# EAGLE design Cansat 2018_V2  (EAGLE 7.6.0)
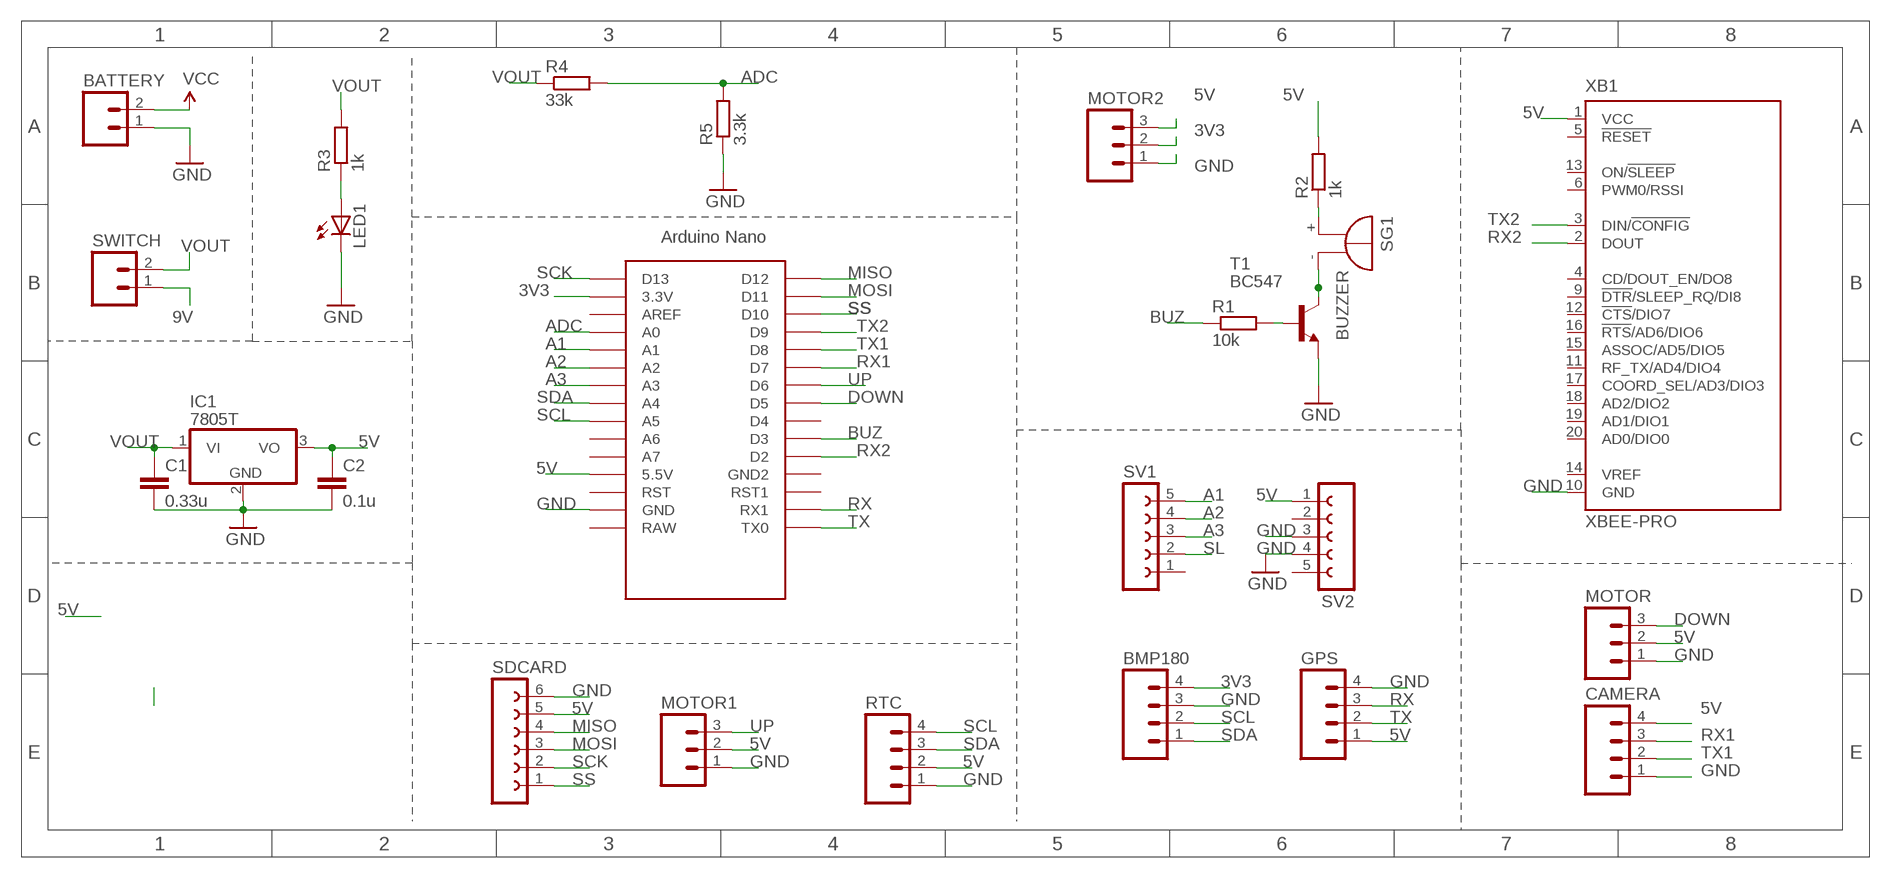
[diagram p0: schematic, sheet 1]

## Parts
BATTERY  M02  [02P]
BMP180  M04  [04P]
C1  0.33u  C-EUC0805  [C0805]
C2  0.1u  C-EUC0805  [C0805]
CAMERA  M04  [04P]
GPS  M04  [04P]
IC1  7805T  [TO220H]
LED1  LED3MM  [LED3MM]
MOTOR  M03  [03P]
MOTOR1  M03  [03P]
MOTOR2  M03  [03P]
R1  10k  R-EU_0207/7  [0207/7]
R2  1k  R-EU_0207/7  [0207/7]
R3  1k  R-EU_0204/7  [0204/7]
R4  33k  R-EU_0207/7  [0207/7]
R5  3.3k  R0207/10  [0207/10]
RTC  M04  [04P]
SDCARD  FE06-1  [FE06]
SG1  BUZZER  [F/TMB]
SV1  FE05-1  [FE05-1]
SV2  FE05-1  [FE05-1]
SWITCH  M02  [02P]
T1  BC547  [TO92]
U$1  NANO  [NANO]
XB1  XBEE-PRO  [XBEE-PRO]

## Nets
3V3: BMP180.4 MOTOR2.2 U$1.3.3V
5V: C2.1 CAMERA.4 GPS.1 IC1.3(VO) MOTOR1.2 MOTOR2.3 MOTOR.2 R2.2 RTC.2 SDCARD.5 SV2.1 U$1.5V(5.5V) XB1.1(VCC)
9V: BATTERY.2 SWITCH.1 ; supply symbol labelled VCC
A1: SV1.5 U$1.A1
A2: SV1.4 U$1.A2
A3: SV1.3 U$1.A3
ADC: R4.2 R5.2 U$1.A0
BUZ: R1.1 U$1.D3
DOWN: MOTOR.3 U$1.D5
GND: BATTERY.1 BMP180.3 C1.2 C2.2 CAMERA.1 GPS.4 IC1.2(GND) LED1.K(C) MOTOR1.1 MOTOR2.1 MOTOR.1 R5.1 RTC.1 SDCARD.6 SV2.3 SV2.4 T1.1(E) U$1.GND XB1.10(GND)
MISO: SDCARD.4 U$1.D12
MOSI: SDCARD.3 U$1.D11
N$1: R1.2 T1.2(B)
N$2: SG1.- T1.3(C)
N$3: R2.1 SG1.+
N$4: LED1.A R3.1
RX: GPS.3 U$1.RX1
RX1: CAMERA.3 U$1.D7
RX2: U$1.D2 XB1.2(DOUT)
SCK: SDCARD.2 U$1.D13
SCL: BMP180.2 RTC.4 U$1.A5
SDA: BMP180.1 RTC.3 U$1.A4
SL: SV1.2
SS: SDCARD.1 U$1.D10
TX: GPS.2 U$1.TX0
TX1: CAMERA.2 U$1.D8
TX2: U$1.D9 XB1.3(DIN/!CONFIG)
UP: MOTOR1.3 U$1.D6
VOUT: C1.1 IC1.1(VI) R3.2 R4.1 SWITCH.2
Unconnected: SV1.1 SV2.2 SV2.5 U$1.A6 U$1.A7 U$1.AREF U$1.D4 U$1.GND1(GND2) U$1.ICSP1 U$1.ICSP2 U$1.ICSP3 U$1.ICSP4 U$1.ICSP5 U$1.ICSP6 U$1.RAW U$1.RST U$1.RST1 XB1.4(CD/DOUT_EN/DO8) XB1.5(!RESET) XB1.6(PWM0/RSSI) XB1.9(!DTR!/SLEEP_RQ/DI8) XB1.11(RF_TX/AD4/DIO4) XB1.12(!CTS!/DIO7) XB1.13(ON/!SLEEP) XB1.14(VREF) XB1.15(ASSOC/AD5/DIO5) XB1.16(!RTS!/AD6/DIO6) XB1.17(COORD_SEL/AD3/DIO3) XB1.18(AD2/DIO2) XB1.19(AD1/DIO1) XB1.20(AD0/DIO0)

## Library data of the parts
BATTERY SWITCH = Arduino_Hackathon_v5:M02: AMP QUICK CONNECTOR
BMP180 CAMERA GPS RTC = con-amp-quick:M04: AMP QUICK CONNECTOR; OC_FARNELL: unknown; OC_NEWARK: unknown
C1 = rcl:C-EU: CAPACITOR, European symbol
C2 = CPLD_FV34:C-EU: CAPACITOR, European symbol
IC1 = linear:78*: Positive VOLTAGE REGULATOR Source: http://cache.national.com/ds/LM/LM78L05.pdf http://www.fairchildsemi.com/ds/LM/LM7805.pdf
LED1 = CEDT_JANUARY_2015_v5:LED
MOTOR MOTOR1 MOTOR2 = con-amp-quick:M03: AMP QUICK CONNECTOR; OC_FARNELL: unknown; OC_NEWARK: unknown
R1-R4 = rcl:R-EU_: RESISTOR, European symbol
R5 = eagle-ltspice:R: RESISTOR, European symbol; SPICEMODEL: NONE; SPICEPREFIX: R
SDCARD = con-lsta:FE06-1: FEMALE HEADER; OC_FARNELL: unknown; OC_NEWARK: unknown
SG1 = Arduino_Hackathon_v5:BUZZER: BUZZER Source: Buerklin; OC_FARNELL: unknown; OC_NEWARK: unknown
SV1 SV2 = con-lsta:FE05-1: FEMALE HEADER; OC_FARNELL: unknown; OC_NEWARK: unknown
T1 = Arduino_Hackathon_v5:BC547: NPN TRANSISTOR Datasheet <https://www.fairchildsemi.com/datasheets/BC/BC547.pdf>
U$1 = Arduino-clone:NANO: Arduino Nano
XB1 = maxstream:XBEE: XBee (TM) /XBee-PRO(TM) OEM RF Modules Source: MaxStream, Inc. xbee_productmanual.pdf; MPN: XBP24-AWI-001; OC_FARNELL: 1337916; OC_NEWARK: 42M2667

## Board
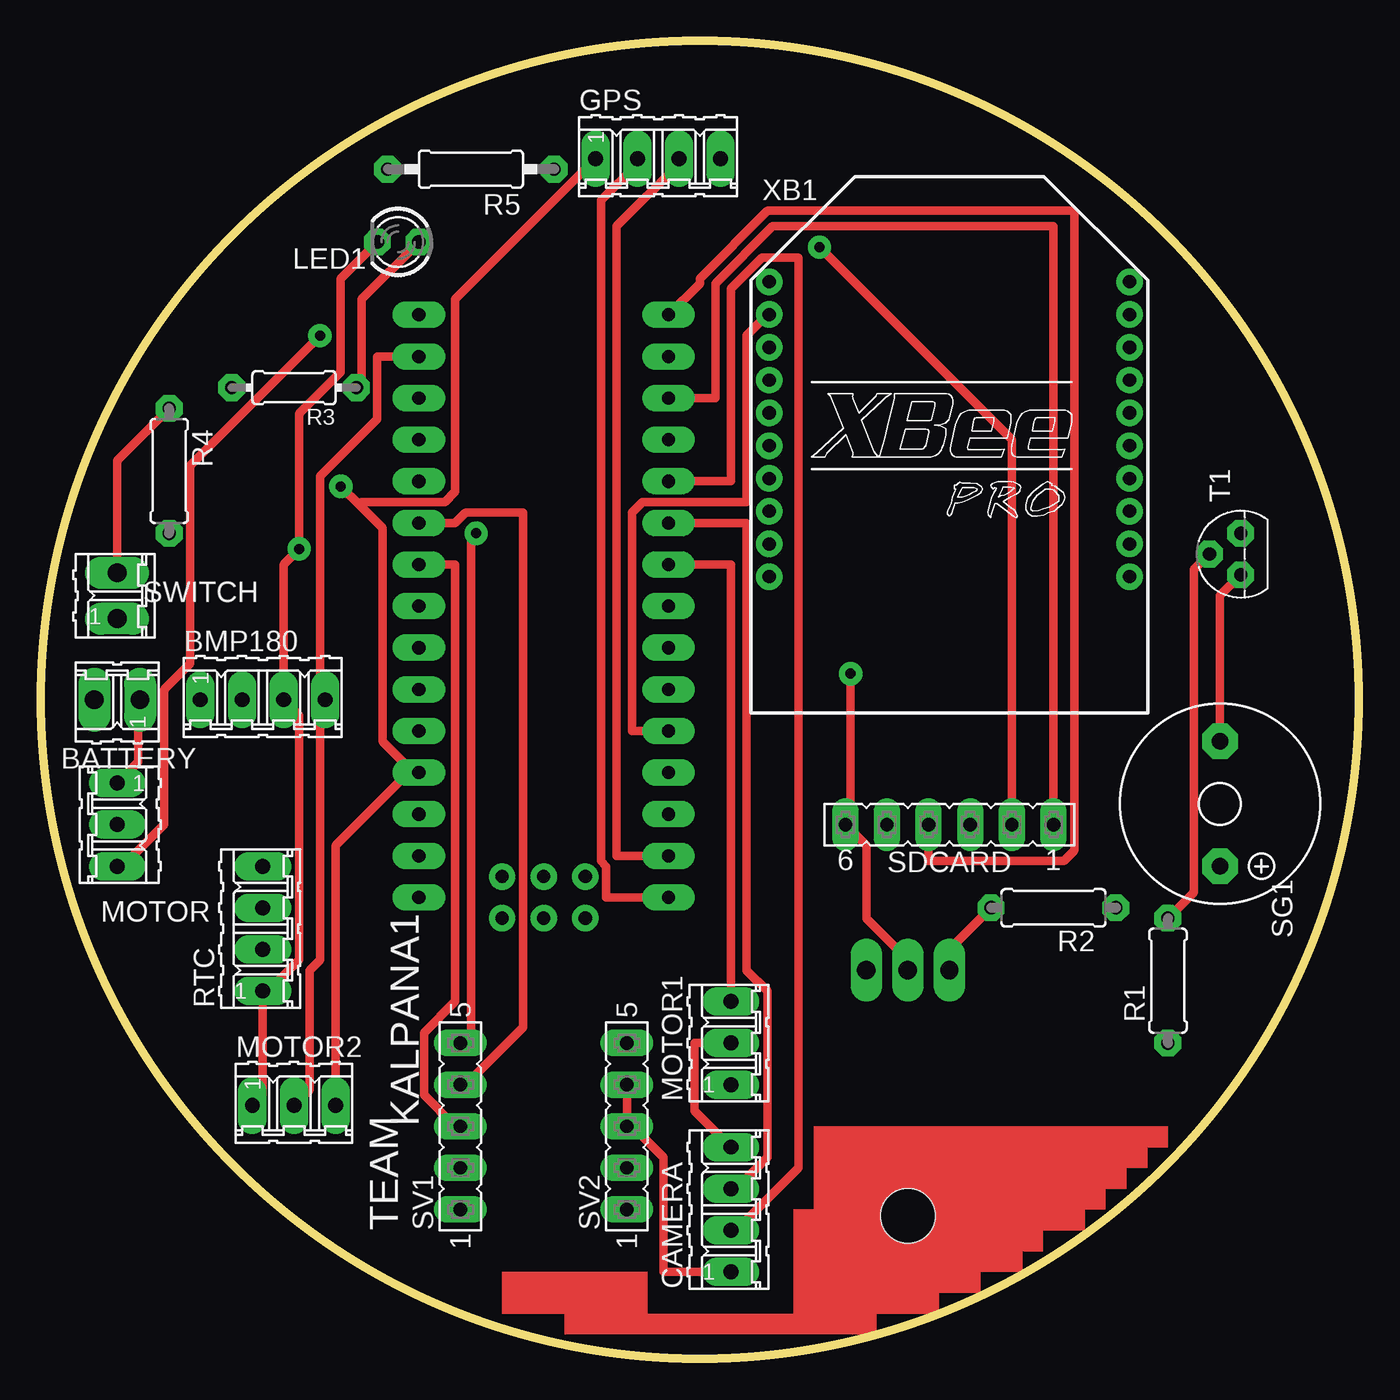
[diagram p1: board, top side]
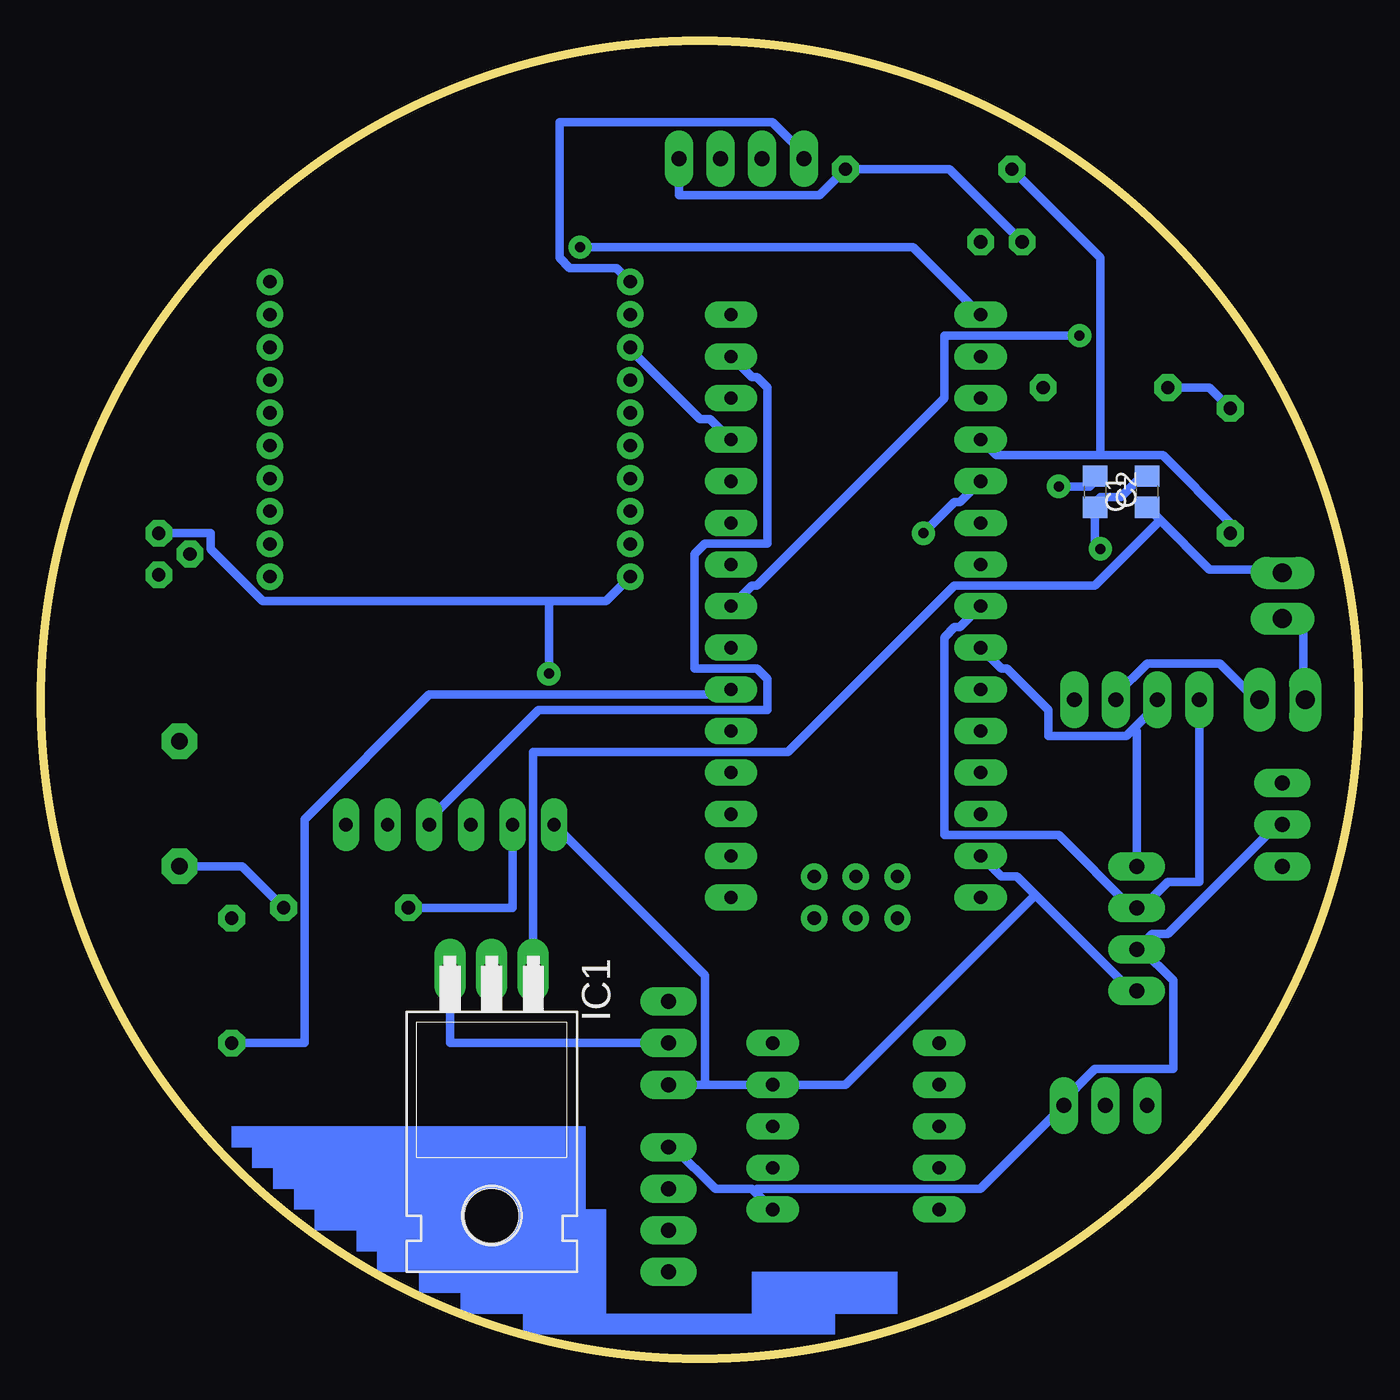
[diagram p2: board, bottom side, seen from below]

Size 80.42 x 80.42 mm. Coordinates in mm from the lower left corner, seen from the top.
Outline: circle at 40.21,40.21 radius 40.21
Copper layers (1*16): Top 0.035mm / dielectric 1.5mm / Bottom 0.035mm
Design rules "default *": minimum track width 20mil, minimum drill 24mil, track to track 8mil, track to pad 8mil, pad to pad 8mil, via to via 8mil, smd to smd 8mil, copper to edge 40mil, drill to drill 8mil, minimum pad ring 16mil, minimum via ring 16mil, stop-mask expansion 4mil, vias tented up to drill 0mil, thermal gap 10mil

### Footprints (pad centres in the part's own frame; a part is rotated, then mirrored left to right if it is on the bottom)
02P = drill 1.143 long: 1 -1.397,0; 2 1.397,0
04P = drill 0.914 long: 1 -3.81,0; 2 -1.27,0; 3 1.27,0; 4 3.81,0
C0805 = smd 1.3 x 1.5: 1 -0.95,0; 2 0.95,0
TO220H = drill 1.118 long: 1 -2.54,-10.16; 2 0,-10.16; 3 2.54,-10.16 | hole 3.302: 0,4.826
LED3MM = drill 0.813 octagon: A -1.27,0; K 1.27,0
03P = drill 0.914 long: 1 -2.54,0; 2 0,0; 3 2.54,0
0207/7 = drill 0.813 octagon: 1 -3.81,0; 2 3.81,0
0204/7 = drill 0.813 octagon: 1 -3.81,0; 2 3.81,0
0207/10 = drill 0.813 octagon: 1 -5.08,0; 2 5.08,0
FE06 = drill 0.813 long: 1 -6.35,0; 2 -3.81,0; 3 -1.27,0; 4 1.27,0; 5 3.81,0; 6 6.35,0
F/TMB = drill 1.016 pad 2.159 octagon: + 3.81,0; - -3.81,0
FE05-1 = drill 0.813 long: 1 -5.08,0; 2 -2.54,0; 3 0,0; 4 2.54,0; 5 5.08,0
TO92 = drill 0.813 octagon: 1 1.27,0; 2 0,1.905; 3 -1.27,0
NANO = drill 0.8 long: 3.3V -10.16,24.13; 5V -10.16,-1.27; A0 -10.16,19.05; A1 -10.16,16.51; A2 -10.16,13.97; A3 -10.16,11.43; A4 -10.16,8.89; A5 -10.16,6.35; A6 -10.16,3.81; A7 -10.16,1.27; AREF -10.16,21.59; D2 5.08,1.27; D3 5.08,3.81; D4 5.08,6.35; D5 5.08,8.89; D6 5.08,11.43; D7 5.08,13.97; D8 5.08,16.51; D9 5.08,19.05; D10 5.08,21.59; D11 5.08,24.13; D12 5.08,26.67; D13 -10.16,26.67; GND -10.16,-6.35; GND1 5.08,-1.27; RAW -10.16,-8.89; RST -10.16,-3.81; RST1 5.08,-3.81; RX1 5.08,-6.35; TX0 5.08,-8.89 | drill 0.8: ICSP1 -5.08,-10.16; ICSP2 -5.08,-7.62; ICSP3 -2.54,-10.16; ICSP4 -2.54,-7.62; ICSP5 0,-10.16; ICSP6 0,-7.62
XBEE-PRO = drill 0.8 pad 1.27: 1 -11,9; 2 -11,7; 3 -11,5; 4 -11,3; 5 -11,1; 6 -11,-1; 7 -11,-3; 8 -11,-5; 9 -11,-7; 10 -11,-9; 11 11,-9; 12 11,-7; 13 11,-5; 14 11,-3; 15 11,-1; 16 11,1; 17 11,3; 18 11,5; 19 11,7; 20 11,9

### Placement (x,y rotation side)
BATTERY  4.65,40.21 180 top
BMP180  13.54,40.21 0 top
C1  12.91,52.91 90 bottom
C2  16.08,52.91 270 bottom
CAMERA  42.12,9.1 90 top
GPS  37.67,73.23 0 top
IC1  52.91,13.54 180 bottom
LED1  21.8,68.15 180 top
MOTOR  4.65,32.59 270 top
MOTOR1  42.12,19.26 90 top
MOTOR2  15.45,15.45 0 top
R1  68.79,23.07 90 top
R2  61.8,27.51 180 top
R3  15.45,59.26 180 top
R4  7.83,54.18 270 top
R5  26.24,72.6 180 top
RTC  13.54,26.24 90 top
SDCARD  55.45,32.59 180 top
SG1  71.96,33.86 270 top
SV1  25.61,14.18 90 top
SV2  35.77,14.18 90 top
SWITCH  4.65,46.56 90 top
T1  73.23,49.1 90 top
U$1  33.23,37.04 0 top
XB1  55.45,56.72 0 top

### Tracks (layer width: path | path; a pad name or v marks a point on that pad's centre or on a via)
3V3
  Top 0.508: U$1.3.3V 20.53,61.17 20.53,57.36 17.03,53.86 17.03,40.53 BMP180.4 17.03,40.21 17.03,24.34 16.4,23.7 16.4,16.4 MOTOR2.2
5V  (via drill 0.61)
  Top 0.508: 19.42,52.12 20.84,50.69 20.84,37.67 22.75,35.77 U$1.5V 22.43,35.77 17.99,31.32 MOTOR2.3 | 19.42,52.12 v18.3,53.23 | GPS.1 25.29,64.66 25.29,52.91 24.65,52.28 19.57,52.28 19.42,52.12 | R2.2 55.45,24.97 IC1.3 | MOTOR1.2 39.89,19.26 39.89,15.13 CAMERA.4
  Bottom 0.508: GPS.1 33.86,73.55 35.77,75.45 48.78,75.45 48.78,67.2 48.15,66.56 45.29,66.56 44.66,65.93 XB1.1 | v18.3,53.23 16.4,53.23 16.08,53.55 C2.1 | MOTOR.2 4.97,32.59 11.64,25.92 12.59,25.92 RTC.2 13.22,24.97 11.32,23.07 11.32,17.67 16.08,17.67 18.3,15.45 MOTOR2.3 23.07,10.37 36.72,10.37 36.88,10.21 | SDCARD.5 51.64,27.51 R2.2 | 36.88,10.21 37.04,10.37 39.26,10.37 41.8,12.91 CAMERA.4 | 36.88,10.21 SV2.1 | IC1.3 55.45,19.26 MOTOR1.2
9V
  Bottom 0.508: BATTERY.2 3.38,40.21 3.38,44.97 4.65,44.97 SWITCH.1
A1  (via drill 0.61)
  Top 0.508: v26.56,50.37 26.24,50.05 26.24,19.89 SV1.5
  Bottom 0.508: U$1.A1 24.34,52.28 24.65,52.28 v26.56,50.37
A2
  Top 0.508: U$1.A2 25.29,51.01 25.92,51.64 29.42,51.64 29.42,20.21 25.92,16.72 SV1.4
A3
  Top 0.508: U$1.A3 25.29,48.47 25.29,21.8 23.38,19.89 23.38,16.08 25.29,14.18 SV1.3
ADC
  Bottom 0.508: U$1.A0 22.11,55.13 15.76,55.13 | 15.76,55.13 11.95,55.13 7.83,51.01 R4.2 | R5.2 15.76,67.2 15.76,55.13
BUZ
  Bottom 0.508: U$1.D3 38.62,40.53 56.72,40.53 64.34,32.91 64.34,19.26 R1.1
DOWN  (via drill 0.61)
  Top 0.508: v17.03,62.44 9.1,54.5 9.1,42.43 7.51,40.85 7.51,32.59 4.97,30.05 MOTOR.3
  Bottom 0.508: U$1.D5 37.04,47.2 36.72,47.2 25.29,58.63 25.29,62.44 v17.03,62.44
GND  (via drill 0.61)
  Top 0.508: MOTOR.1 5.92,36.4 5.92,40.21 BATTERY.1 | LED1.K 18.3,65.93 18.3,60.21 15.76,57.67 v15.76,49.42 14.81,48.47 BMP180.3 15.76,39.26 15.76,24.34 13.54,22.11 | MOTOR2.1 13.54,16.08 13.54,22.11 | IC1.2 52.91,24.34 50.37,26.88 50.37,31.32 SDCARD.6 49.42,32.59 v49.42,41.8 | SV2.4 35.77,14.49 | CAMERA.1 37.99,5.29 37.99,12.27 35.77,14.49 | 35.77,14.49 SV2.3 | 13.54,22.11 RTC.1
  Bottom 0.508: LED1.K 24.97,72.6 R5.1 32.91,71.01 41.48,71.01 GPS.4 | C1.2 12.91,53.55 13.54,53.55 14.49,52.59 15.76,52.59 16.08,52.28 C2.2 16.08,49.42 v15.76,49.42 | BMP180.3 14.81,40.53 12.91,42.43 8.46,42.43 6.24,40.21 BATTERY.1 | 49.42,46.24 66.88,46.24 70.06,49.42 70.06,50.37 T1.1 | 49.42,46.24 45.93,46.24 44.66,47.51 XB1.10 | U$1.GND 21.8,29.42 20.84,29.42 19.73,28.31 | 19.73,28.31 13.86,22.43 RTC.1 | 39.89,16.72 SV2.4 31.32,16.72 19.73,28.31 | 39.89,16.72 MOTOR1.1 | SDCARD.6 39.89,23.38 39.89,16.72 | v49.42,41.8 49.42,46.24
MISO
  Top 0.508: U$1.D12 40.21,65.61 40.21,65.93 44.34,70.06 63.07,70.06 63.07,31 62.44,30.37 54.18,30.37 SDCARD.4
MOSI
  Bottom 0.508: U$1.D11 37.04,59.9 36.72,59.9 36.08,59.26 36.08,49.74 39.89,49.74 40.53,49.1 40.53,42.12 36.72,42.12 36.08,41.48 36.08,39.58 50.05,39.58 56.72,32.91 SDCARD.3
N$1
  Top 0.508: R1.2 70.37,28.46 70.37,48.15 T1.2
N$2
  Top 0.508: T1.3 71.96,46.56 SG1.-
N$3
  Bottom 0.508: R2.1 68.15,30.05 SG1.+
N$4
  Top 0.508: R3.1 19.57,59.58 19.57,64.66 LED1.A
RX
  Top 0.508: U$1.RX1 35.13,30.69 35.13,69.1 38.94,72.91 GPS.3
RX1
  Top 0.508: U$1.D7 43.07,51.01 43.07,23.7 44.34,22.43 44.34,12.27 42.43,10.37 CAMERA.3
RX2
  Top 0.508: U$1.D2 36.08,38.31 36.08,51.64 36.72,52.28 43.07,52.28 43.07,62.44 44.34,63.71 XB1.2
SCK  (via drill 0.61)
  Top 0.508: v47.51,67.83 59.26,56.09 SDCARD.2
  Bottom 0.508: U$1.D13 27.19,67.83 v47.51,67.83
SCL
  Bottom 0.508: U$1.A5 21.8,42.12 21.48,42.12 18.94,39.58 18.94,37.99 14.18,37.99 13.7,38.47 | 13.7,38.47 12.27,39.89 BMP180.2 | RTC.4 13.54,38.31 13.7,38.47
SDA
  Bottom 0.508: U$1.A4 24.34,44.66 24.65,44.66 25.29,44.02 25.29,31.96 18.3,31.96 13.86,27.51 RTC.3 13.22,27.51 11.64,29.1 9.73,29.1 BMP180.1
SS
  Top 0.508: U$1.D10 41.16,58.63 41.16,65.61 44.66,69.1 61.8,69.1 SDCARD.1
TX
  Top 0.508: U$1.TX0 34.5,28.15 34.5,30.05 34.18,30.37 34.18,70.69 36.4,72.91 GPS.2
TX1
  Top 0.508: U$1.D8 42.12,53.55 42.12,65.29 44.02,67.2 46.24,67.2 46.24,11.64 42.43,7.83 CAMERA.2
TX2
  Bottom 0.508: U$1.D9 39.58,57.36 40.21,57.36 44.34,61.48 XB1.3
UP
  Top 0.508: U$1.D6 42.12,48.47 MOTOR1.3
VOUT
  Top 0.508: R4.1 4.65,54.82 SWITCH.2
  Bottom 0.508: R4.1 9.1,59.26 R3.2 | 12.11,51.17 9.1,48.15 4.65,48.15 SWITCH.2 | 12.11,51.17 C1.1 | IC1.1 50.37,37.04 34.81,37.04 24.65,47.2 16.08,47.2 12.11,51.17
(copper drawn outside any net)
  shapes: Bottom area x12, Top area x31

### Text on the board
tNames: KALPANA1 | TEAM